# EAGLE schematic weight_sens (EAGLE 6.5.0)
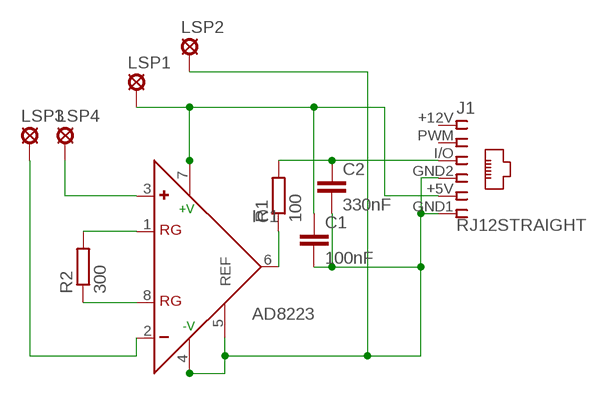
[diagram p0: schematic, sheet 1]

## Parts
C1  100nF  C-EUC1206  [C1206]
C2  330nF  C-EUC1206  [C1206]
IC1  AD8223  AD620R  [SO8]
J1  RJ12STRAIGHT  [RJ12-STRAIGHT]
LSP1  LSP10  [LSP10]
LSP2  LSP10  [LSP10]
LSP3  LSP10  [LSP10]
LSP4  LSP10  [LSP10]
R1  100  R-EU_R1206  [R1206]
R2  300  R-EU_R1206  [R1206]

## Nets
N$1: IC1.1(RG) R2.2
N$2: IC1.8(RG) R2.1
N$4: IC1.2(-) LSP3.MP
N$5: IC1.6(OUT) R1.1
N$6: C1.2 C2.2 IC1.4(-V) IC1.5(REF) J1.GND1 J1.GND2 LSP2.MP
N$8: IC1.3(+) LSP4.MP
N$9: C1.1 IC1.7(+V) J1.+5V LSP1.MP
SIGN: C2.1 J1.I/O R1.2
Unconnected: J1.+12V J1.PWM

## Library data of the parts
C1 C2 = rcl:C-EU: CAPACITOR, European symbol
IC1 = analog-devices:AD620: Low Cost, Low Power, Instrumentation Amplifier Source: http://www.analog.com/UploadedFiles/Data_Sheets/37793330023930AD620_e.pdf; MPN: AD620AR; OC_FARNELL: 1464424; OC_NEWARK: 05F7109
J1 = lpatiny:RJ12: CORCOM Modular RJ Jacks No Shield Source: www.tycoelectronics.com .. ENG_DS_1654001_1099_RJ_L_0507.pdf
LSP1-LSP4 = solpad:LSP10: SOLDER PAD drill 1.0 mm, distributor Buerklin, 12H555
R1 R2 = resistor:R-EU_: RESISTOR, European symbol

## Net classes
0 default: width 0.457 mm